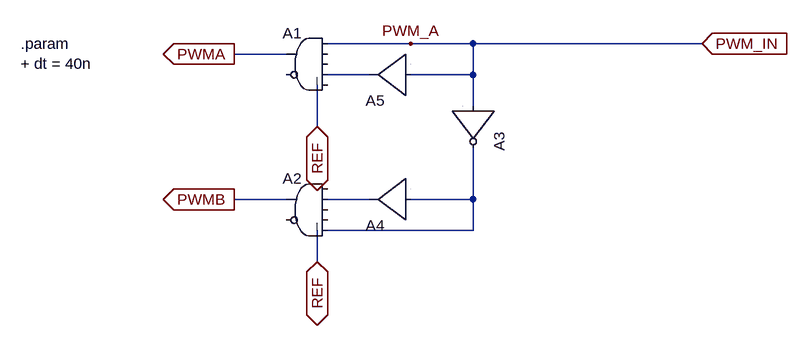
[diagram p0: schematic PWM_DT.asc]
PWM_DT.asc, the LTspice schematic file:
Version 4
SHEET 1 880 680
WIRE 192 32 64 32
WIRE 288 32 192 32
WIRE 640 32 288 32
WIRE 0 48 -80 48
WIRE 128 80 64 80
WIRE 288 80 288 32
WIRE 288 80 192 80
WIRE 288 128 288 80
WIRE 48 160 48 96
WIRE 0 272 -80 272
WIRE 128 272 64 272
WIRE 288 272 288 192
WIRE 288 272 192 272
WIRE 288 320 288 272
WIRE 288 320 64 320
WIRE 48 368 48 320
FLAG -80 48 PWMA
IOPIN -80 48 Out
FLAG -80 272 PWMB
IOPIN -80 272 Out
FLAG 640 32 PWM_IN
IOPIN 640 32 In
FLAG 192 32 PWM_A
FLAG 48 160 REF
IOPIN 48 160 BiDir
FLAG 48 368 REF
IOPIN 48 368 BiDir
SYMBOL Digital/and 32 0 M0
SYMATTR InstName A1
SYMATTR SpiceLine tau=1n
SYMBOL Digital/and 32 224 M0
SYMATTR InstName A2
SYMATTR SpiceLine tau=1n
SYMBOL Digital/inv 352 128 R90
SYMATTR InstName A3
SYMATTR SpiceLine tau=1n
SYMBOL Digital/buf1 192 336 R180
SYMATTR InstName A4
SYMATTR SpiceLine td = {dt}
SYMBOL Digital/buf1 192 144 R180
SYMATTR InstName A5
SYMATTR SpiceLine td = {dt}
TEXT -408 32 Left 2 !.param\n+ dt = 40n

The netlist it stands for:
* PWM_DT.asc
A1 PWM_A REF REF N001 REF REF PWMA REF AND tau=1n
A2 REF N002 REF REF N003 REF PWMB REF AND tau=1n
A3 PWM_A 0 0 0 0 N003 0 0 BUF tau=1n
A4 N003 0 0 0 0 0 N002 0 BUF td = {dt}
A5 PWM_A 0 0 0 0 0 N001 0 BUF td = {dt}
.param
+ dt = 40n
.backanno
.end